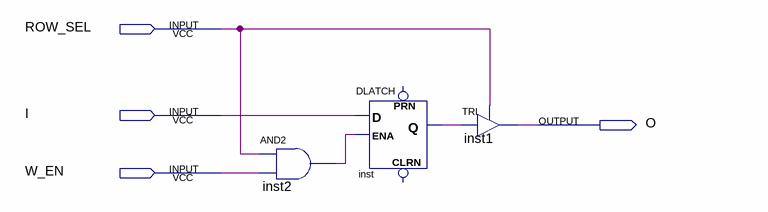
[diagram p0: schematic sheet]
// Quartus schematic Memory_Cell.bdf as structural Verilog: 3 symbols, 4 pins
module Memory_Cell (
  input  ROW_SEL,
  input  I,
  input  W_EN,
  output O
);

  wire inst2_out, inst_q;

  and inst2 (inst2_out, ROW_SEL, W_EN);
  DLATCH inst (.D(I), .ENA(inst2_out), .Q(inst_q));  // open: CLRN, PRN
  TRI inst1 (.IN(inst_q), .OE(ROW_SEL), .OUT(O));
endmodule
